# EAGLE design rev1 (EAGLE 6.4)
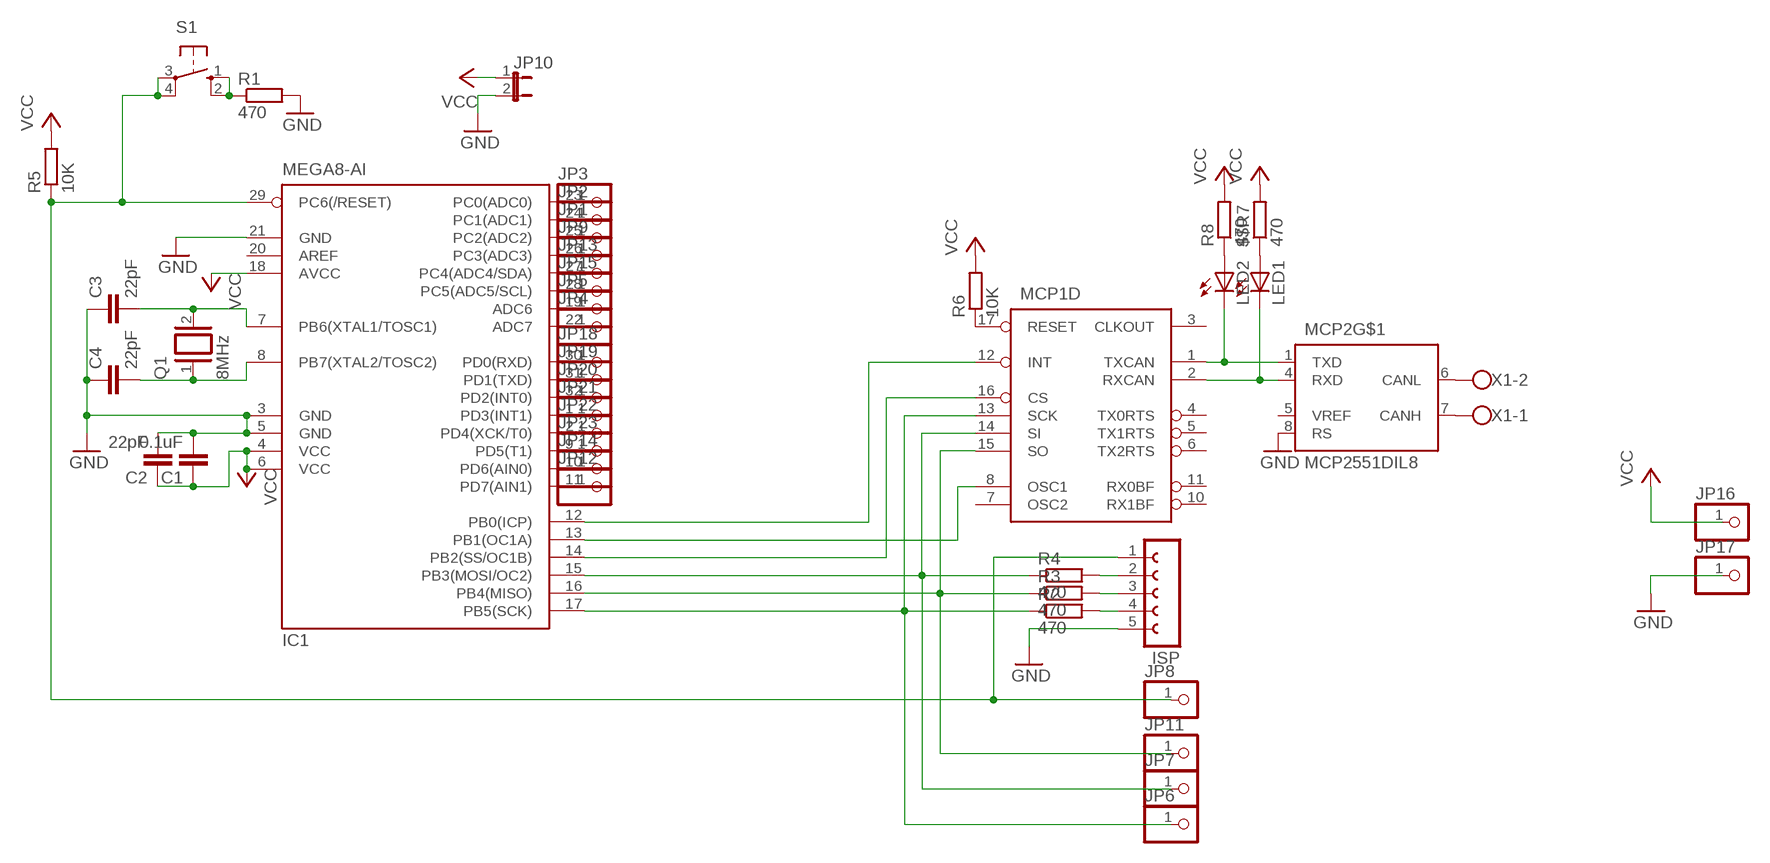
[diagram p0: schematic, sheet 1]

## Parts
$$R7  470  R-EU_R0603  [R0603]
C1  0.1uF  C-EUC0603  [C0603]
C2  22pF  C-EUC0603  [C0603]
C3  22pF  C-EUC0603  [C0603]
C4  22pF  C-EUC0603  [C0603]
IC1  MEGA8-AI  [TQFP32-08]
ISP  FE05-1  [FE05-1]
JP1  PINHD-1X1  [1X01]
JP2  PINHD-1X1  [1X01]
JP3  PINHD-1X1  [1X01]
JP4  PINHD-1X1  [1X01]
JP5  PINHD-1X1  [1X01]
JP6  PINHD-1X1  [1X01]
JP7  PINHD-1X1  [1X01]
JP8  PINHD-1X1  [1X01]
JP9  PINHD-1X1  [1X01]
JP10  JUMPER-2PTH  [1X02]
JP11  PINHD-1X1  [1X01]
JP12  PINHD-1X1  [1X01]
JP13  PINHD-1X1  [1X01]
JP14  PINHD-1X1  [1X01]
JP15  PINHD-1X1  [1X01]
JP16  PINHD-1X1  [1X01]
JP17  PINHD-1X1  [1X01]
JP18  PINHD-1X1  [1X01]
JP19  PINHD-1X1  [1X01]
JP20  PINHD-1X1  [1X01]
JP21  PINHD-1X1  [1X01]
JP22  PINHD-1X1  [1X01]
JP23  PINHD-1X1  [1X01]
LED1  LEDCHIP-LED0603  [CHIP-LED0603]
LED2  LEDCHIP-LED0603  [CHIP-LED0603]
MCP1  MCP2515P  [DIL18]
MCP2  MCP2551DIL8  [DIL08]
Q1  8MHz  XTAL/S  [QS]
R1  470  R-EU_R0603  [R0603]
R2  470  R-EU_R0603  [R0603]
R3  470  R-EU_R0603  [R0603]
R4  470  R-EU_R0603  [R0603]
R5  10K  R-EU_R0603  [R0603]
R6  10K  R-EU_R0603  [R0603]
R8  470  R-EU_R0603  [R0603]
S1  10-XX  [B3F-10XX]
X1  W237-102  [W237-102]

## Nets
GND: C1.2 C2.2 C3.1 C4.1 IC1.3(GND) IC1.5(GND) IC1.21(GND) ISP.5 JP10.2 JP17.1 MCP2.8(RS) R1.2
N$1: IC1.17(PB5(SCK)) JP6.1 MCP1.13(D:SCK) R2.1
N$2: IC1.16(PB4(MISO)) JP11.1 MCP1.15(D:SO) R3.1
N$3: IC1.15(PB3(MOSI/OC2)) JP7.1 MCP1.14(D:SI) R4.1
N$4: IC1.14(PB2(SS/OC1B)) MCP1.16(D:CS)
N$5: IC1.13(PB1(OC1A)) MCP1.8(D:OSC1)
N$7: LED2.C MCP1.1(D:TXCAN) MCP2.1(TXD)
N$9: C4.2 IC1.8(PB7(XTAL2/TOSC2)) Q1.1
N$10: C3.2 IC1.7(PB6(XTAL1/TOSC1)) Q1.2
N$12: MCP1.17(D:RESET) R6.1
N$13: R1.1 S1.1(S) S1.2(S1)
N$14: IC1.12(PB0(ICP)) MCP1.12(D:INT)
N$15: ISP.2 R4.2
N$16: ISP.3 R3.2
N$17: ISP.4 R2.2
N$18: LED2.A R8.1
N$19: $$R7.1 LED1.A
N$20: IC1.23(PC0(ADC0)) JP3.1
N$21: IC1.24(PC1(ADC1)) JP2.1
N$22: IC1.25(PC2(ADC2)) JP1.1
N$23: IC1.26(PC3(ADC3)) JP9.1
N$24: IC1.27(PC4(ADC4/SDA)) JP13.1
N$25: IC1.28(PC5(ADC5/SCL)) JP15.1
N$26: IC1.19(ADC6) JP5.1
N$27: IC1.22(ADC7) JP4.1
N$28: IC1.30(PD0(RXD)) JP18.1
N$29: IC1.31(PD1(TXD)) JP19.1
N$30: IC1.32(PD2(INT0)) JP20.1
N$31: IC1.1(PD3(INT1)) JP21.1
N$32: IC1.2(PD4(XCK/T0)) JP22.1
N$33: IC1.9(PD5(T1)) JP23.1
N$34: IC1.10(PD6(AIN0)) JP14.1
N$35: IC1.11(PD7(AIN1)) JP12.1
N$36: MCP2.6(CANL) X1.2
N$37: MCP2.7(CANH) X1.1
RESET: IC1.29(PC6(/RESET)) ISP.1 JP8.1 R5.1 S1.3(P) S1.4(P1)
RXLED: LED1.C MCP1.2(D:RXCAN) MCP2.4(RXD)
VCC: $$R7.2 C1.1 C2.1 IC1.4(VCC) IC1.6(VCC) IC1.18(AVCC) JP10.1 JP16.1 R5.2 R6.2 R8.2
Unconnected: IC1.20(AREF) MCP1.3(D:CLKOUT) MCP1.4(D:TX0RTS) MCP1.5(D:TX1RTS) MCP1.6(D:TX2RTS) MCP1.7(D:OSC2) MCP1.10(D:RX1BF) MCP1.11(D:RX0BF) MCP2.5(VREF)

## Power pins joined to a net without a drawn wire
GND: MCP1.9(P:GND) MCP2.2(GND)
VCC: MCP1.18(P:VCC) MCP2.3(VCC)

## Library data of the parts
$$R7 R1-R6 R8 = resistor:R-EU_: RESISTOR, European symbol; OC_NEWARK: unknown
C1-C4 = resistor:C-EU: CAPACITOR, European symbol; OC_NEWARK: unknown
IC1 = atmel:MEGA8: MICROCONTROLLER 8 Kbytes FLASH, 1 kbytes SRAM, 512 bytes EEPROM, USART, 6-channel 10 bit ADC, 2-channel 8 bit ADC Pin compatible with Atmega48, ATMega88, ATMega168 Source: avr.lbr; MPN: ATMEGA8-16AU; OC_FARNELL: 9171371; OC_NEWARK: unknown
ISP = con-lsta:FE05-1: FEMALE HEADER; OC_FARNELL: unknown; OC_NEWARK: unknown
JP1-JP9 JP11-JP23 = pinhead:PINHD-1X1: PIN HEADER
JP10 = SparkFun-Passives:JUMPER-2: Jumper Basic 0.1" spaced jumper. Use with breakaway headers.
LED1 LED2 = led:LED: LED OSRAM: - CHIPLED LG R971, LG N971, LY N971, LG Q971, LY Q971, LO R971, LY R971 LH N974, LH R974 LS Q976, LO Q976, LY Q976 LO Q996 - Hyper CHIPLED LW Q18S LB Q993, LB Q99A, LB R99A - SideLED LS A670, LO A670, LY A670, LG A670, LP A670 LB A673, LV A673, LT A673, LW A673 LH A674 LY A675 LS A676, LA A676, LO A676, LY A676, LW A676 LS A679, LY A679, LG A679 - Hyper Micro SIDELED® LS Y876, LA Y876, LO Y876, LY Y876 LT Y87S - SmartLED LW L88C, LW L88S LB L89C, LB L89S, LG L890 LS L89K, LO L89K, LY L89K LS L896, LA L896, LO L896, LY L896 - TOPLED LS T670, LO T670, LY T670, LG T670, LP T670 LSG T670, LSP T670, LSY T670, LOP T670, LYG T670 LG T671, LOG T671, LSG T671 LB T673, LV T673, LT T673, LW T673 LH T674 LS T676, LA T676, LO T676, LY T676, LB T676, LH T676, LSB T676, LW T676 LB T67C, LV T67C, LT T67C, LS T67K, LO T67K, LY T67K, LW E67C LS E67B, LA E67B, LO E67B, LY E67B, LB E67C, LV E67C, LT E67C LW T67C LS T679, LY T679, LG T679 LS T770, LO T770, LY T770, LG T770, LP T770 LB T773, LV T773, LT T773, LW T773 LH T774 LS E675, LA E675, LY E675, LS T675 LS T776, LA T776, LO T776, LY T776, LB T776 LHGB T686 LT T68C, LB T68C - Hyper Mini TOPLED® LB M676 - Mini TOPLED Santana® LG M470 LS M47K, LO M47K, LY M47K Source: http://www.osram.convergy.de LUXEON: - LUMILED® LXK2-PW12-R00, LXK2-PW12-S00, LXK2-PW14-U00, LXK2-PW14-V00 LXK2-PM12-R00, LXK2-PM12-S00, LXK2-PM14-U00 LXK2-PE12-Q00, LXK2-PE12-R00, LXK2-PE12-S00, LXK2-PE14-T00, LXK2-PE14-U00 LXK2-PB12-K00, LXK2-PB12-L00, LXK2-PB12-M00, LXK2-PB14-N00, LXK2-PB14-P00, LXK2-PB14-Q00 LXK2-PR12-L00, LXK2-PR12-M00, LXK2-PR14-Q00, LXK2-PR14-R00 LXK2-PD12-Q00, LXK2-PD12-R00, LXK2-PD12-S00 LXK2-PH12-R00, LXK2-PH12-S00 LXK2-PL12-P00, LXK2-PL12-Q00, LXK2-PL12-R00 Source: www.luxeon.com KINGBRIGHT: KA-3528ASYC Source: www.kingbright.com
MCP1 = can:MCP2515: MC2515 Stand-Alone CAN Controller With SPI Interface, Microchip; OC_NEWARK: unknown
MCP2 = can:MCP2551: CAN Tranceiver Microchip; OC_NEWARK: unknown
Q1 = special:XTAL/S: CRYSTAL; OC_NEWARK: unknown
S1 = switch-omron:10-XX: OMRON SWITCH; MPN: B3F-1000; OC_FARNELL: 176432; OC_NEWARK: 36M3542
X1 = con-wago-500:W237-102: WAGO SCREW CLAMP; MPN: 237-102; OC_FARNELL: unknown; OC_NEWARK: 70K9898

## Board
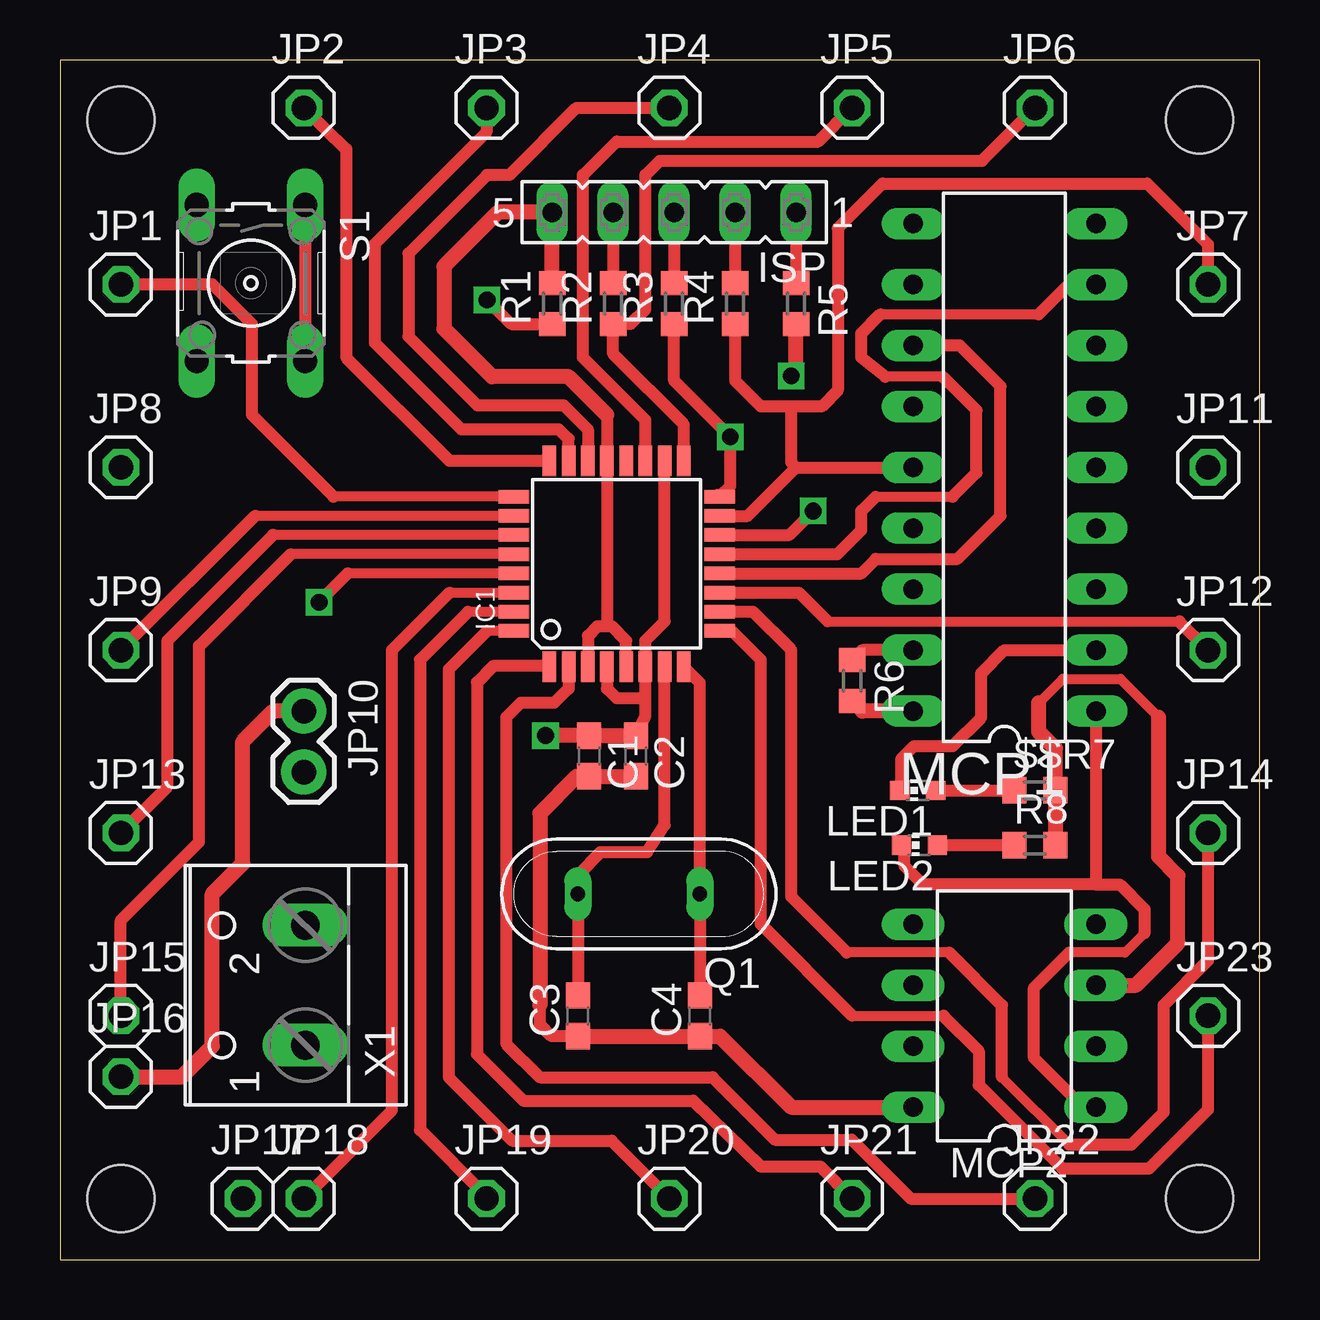
[diagram p1: board, top side]
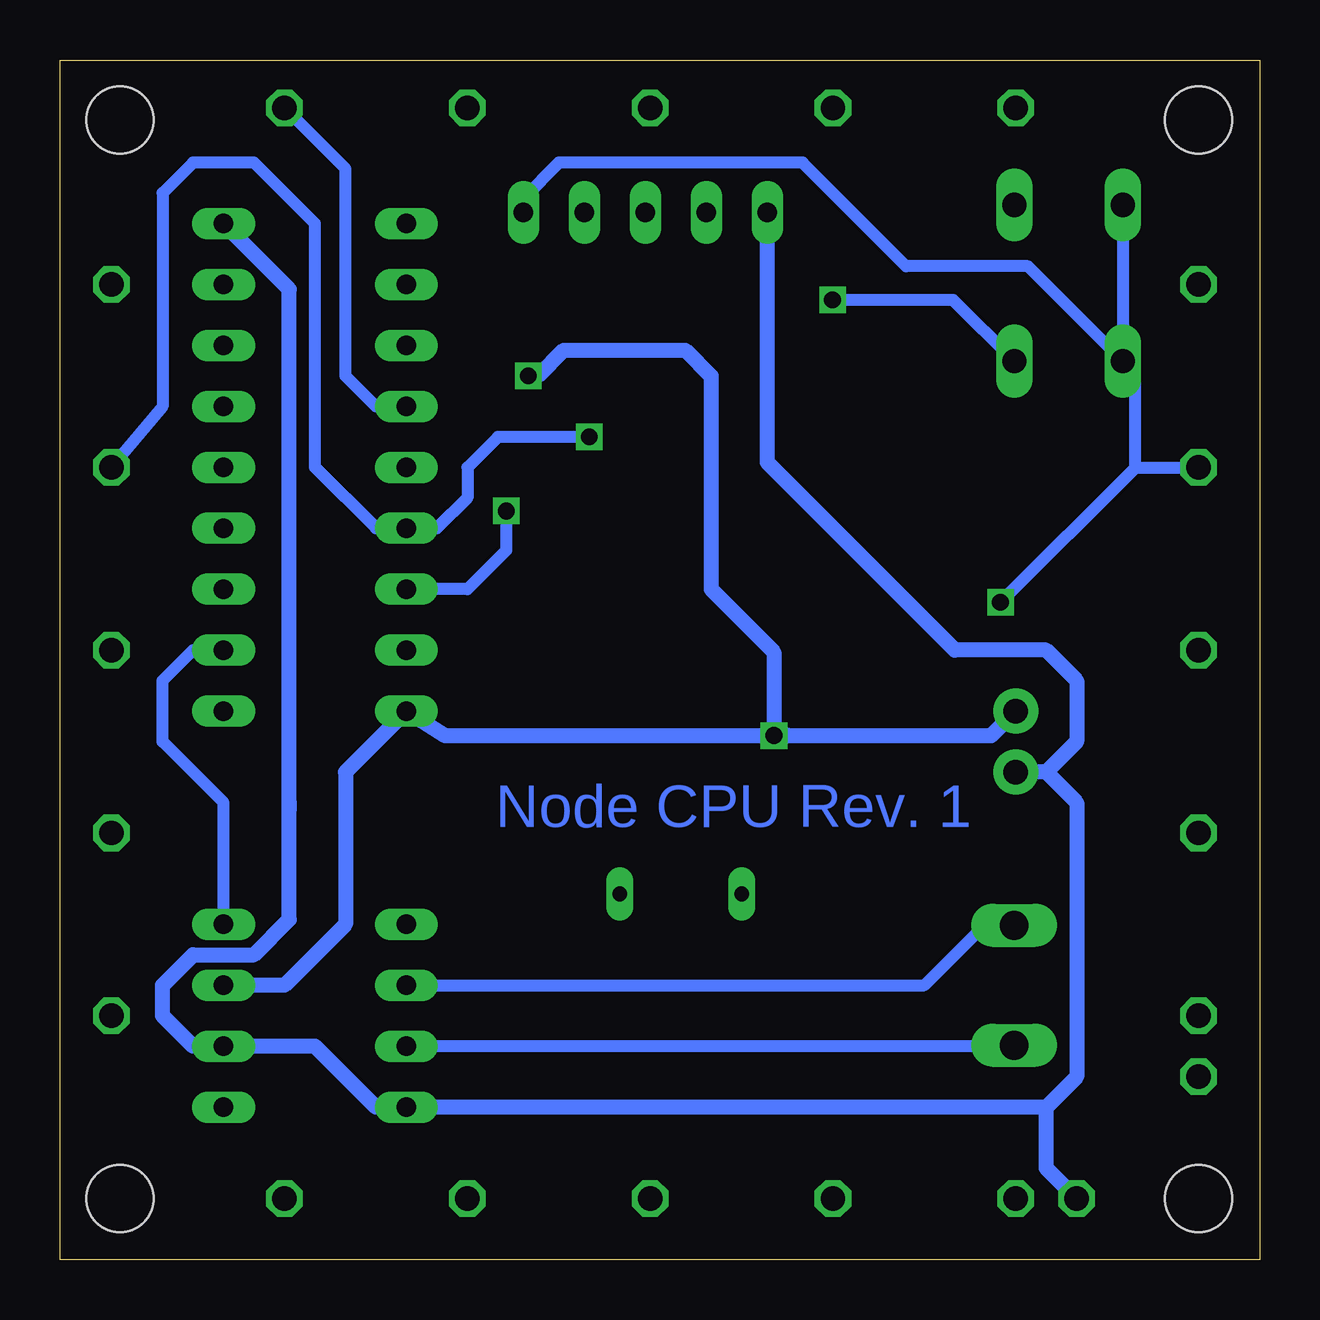
[diagram p2: board, bottom side, seen from below]

Size 50 x 50 mm. Coordinates in mm from the lower left corner, seen from the top.
Outline: 0,0 50,0 50,50 0,50 0,0
Copper layers (1*16): Top 0.035mm / dielectric 1.5mm / Bottom 0.035mm
Design rules "default": minimum track width 10mil, minimum drill 24mil, track to track 8mil, track to pad 8mil, pad to pad 8mil, via to via 8mil, smd to smd 8mil, copper to edge 40mil, drill to drill 8mil, minimum pad ring 10mil, minimum via ring 8mil, stop-mask expansion 4mil, vias tented up to drill 0mil, thermal gap 10mil
Holes 2.8 mm at 2.54,47.5 47.5,47.5 47.5,2.54 2.54,2.54

### Footprints (pad centres in the part's own frame; a part is rotated, then mirrored left to right if it is on the bottom)
R0603 = smd 1 x 1.1: 1 -0.85,0; 2 0.85,0
C0603 = smd 1.1 x 1: 1 -0.85,0; 2 0.85,0
TQFP32-08 = smd 1.27 x 0.559: 1 -4.293,2.8; 2 -4.293,2; 3 -4.293,1.2; 4 -4.293,0.4; 5 -4.293,-0.4; 6 -4.293,-1.2; 7 -4.293,-2; 8 -4.293,-2.8; 17 4.293,-2.8; 18 4.293,-2; 19 4.293,-1.2; 20 4.293,-0.4; 21 4.293,0.4; 22 4.293,1.2; 23 4.293,2; 24 4.293,2.8 | smd 0.559 x 1.27: 9 -2.8,-4.293; 10 -2,-4.293; 11 -1.2,-4.293; 12 -0.4,-4.293; 13 0.4,-4.293; 14 1.2,-4.293; 15 2,-4.293; 16 2.8,-4.293; 25 2.8,4.293; 26 2,4.293; 27 1.2,4.293; 28 0.4,4.293; 29 -0.4,4.293; 30 -1.2,4.293; 31 -2,4.293; 32 -2.8,4.293
FE05-1 = drill 0.813 long: 1 -5.08,0; 2 -2.54,0; 3 0,0; 4 2.54,0; 5 5.08,0
1X01 = drill 1.016 octagon: 1 0,0
1X02 = drill 1.016 pad 1.88: 1 0,0; 2 2.54,0
CHIP-LED0603 = smd 0.8 x 0.8: A 0,-0.75; C 0,0.75
DIL18 = drill 0.813 long: 1 -10.16,-3.81; 2 -7.62,-3.81; 3 -5.08,-3.81; 4 -2.54,-3.81; 5 0,-3.81; 6 2.54,-3.81; 7 5.08,-3.81; 8 7.62,-3.81; 9 10.16,-3.81; 10 10.16,3.81; 11 7.62,3.81; 12 5.08,3.81; 13 2.54,3.81; 14 0,3.81; 15 -2.54,3.81; 16 -5.08,3.81; 17 -7.62,3.81; 18 -10.16,3.81
DIL08 = drill 0.813 long: 1 -3.81,-3.81; 2 -1.27,-3.81; 3 1.27,-3.81; 4 3.81,-3.81; 5 3.81,3.81; 6 1.27,3.81; 7 -1.27,3.81; 8 -3.81,3.81
QS = drill 0.61 long: 1 -2.54,0; 2 2.54,0
B3F-10XX = drill 1.016 long: 1 -3.251,2.261; 2 3.251,2.261; 3 -3.251,-2.261; 4 3.251,-2.261
W237-102 = drill 1.194 long: 1 -2.5,-1.27; 2 2.5,-1.27

### Placement (x,y rotation side)
$$R7  40.64,19.56 0 top
C1  22.06,20.99 270 top
C2  24,20.99 270 top
C3  21.59,10.16 90 top
C4  26.67,10.16 90 top
IC1  23.2,29 90 top
ISP  25.6,43.65 180 top
JP1  2.54,40.64 0 top
JP2  10.16,48.01 0 top
JP3  17.78,48.01 0 top
JP4  25.4,48.01 0 top
JP5  33.02,48.01 0 top
JP6  40.64,48.01 0 top
JP7  47.86,40.64 0 top
JP8  2.54,33.02 0 top
JP9  2.54,25.4 0 top
JP10  10.16,22.86 270 top
JP11  47.86,33.02 0 top
JP12  47.86,25.4 0 top
JP13  2.54,17.78 0 top
JP14  47.86,17.78 0 top
JP15  2.54,10.16 0 top
JP16  2.54,7.62 0 top
JP17  7.62,2.54 0 top
JP18  10.16,2.54 0 top
JP19  17.78,2.54 0 top
JP20  25.4,2.54 0 top
JP21  33.02,2.54 0 top
JP22  40.64,2.54 0 top
JP23  47.86,10.16 0 top
LED1  35.75,19.56 90 top
LED2  35.82,17.27 90 top
MCP1  39.37,33.02 90 top
MCP2  39.37,10.16 90 top
Q1  24.13,15.24 180 top
R1  20.52,39.84 90 top
R2  23.06,39.84 90 top
R3  25.6,39.84 90 top
R4  28.14,39.84 90 top
R5  30.68,39.84 270 top
R6  33.02,24.13 270 top
R8  40.64,17.27 0 top
S1  7.96,40.7 270 top
X1  8.96,11.43 90 top

### Tracks (layer width: path | path; a pad name or v marks a point on that pad's centre or on a via)
GND
  Top 0.305: R1.2 20.5,40.67
  Top 0.508: 22.8,35.2 IC1.21 22.8,26.4 | IC1.3 22,26 22.4,26.4 22.8,26.4 | IC1.5 23.6,25.8 23,26.4 22.8,26.4 | 21.29,9.31 20.49,9.31 20,9.8 20,10.6
  Top 0.635: 20,10.6 20,18.6 21.54,20.14 C1.2 C2.2 | 21.29,9.31 C3.1 C4.1 27.52,9.31 30.48,6.35 MCP2.8 | 22.8,35.2 21.2,36.8 18,36.8 16,38.8 16,41.4 18.25,43.65 ISP.5 20.52,40.79 20.47,40.74 R1.2 20.43,40.6
  Bottom 0.635: 40.44,19.05 40.44,18.78 | ISP.5 20.52,33.22 12.7,25.4 8.89,25.4 7.62,24.13 7.62,21.59 8.89,20.32 | 8.89,6.35 7.62,7.62 7.62,19.05 8.89,20.32 | 8.89,6.35 MCP2.8 36.83,6.35 39.37,8.89 MCP2.2 44.45,8.89 45.72,10.16 45.72,11.43 44.45,12.7 41.91,12.7 40.44,14.17 40.44,19.05 | 8.89,20.32 JP10.2 | JP17.1 8.89,3.81 8.89,6.35 | 40.44,19.05 40.44,40.44 MCP1.9
N$1
  Top 0.508: JP6.1 38.43,45.8 25,45.8 24.4,45.2 24.4,39.6 23.79,38.99 R2.1 23.06,37.74 26,34.8 IC1.17
  Bottom 0.508: MCP1.13 36.83,35.56 38.1,36.83 38.1,45.47 JP6.1
N$2  (via drill 0.7)
  Top 0.508: 25.78,38.99 R3.1 25.6,36.63 v27.94,34.29 27.94,32.25 IC1.16 27.41,31.88
  Bottom 0.508: JP11.1 45.72,35.56 45.72,44.45 44.45,45.72 41.91,45.72 39.37,43.18 39.37,33.02 36.83,30.48 MCP1.15 34.29,30.48 33.02,31.75 33.02,33.02 31.75,34.29 v27.94,34.29
N$3
  Top 0.508: 28.32,38.99 R4.1 28.14,36.63 29.21,35.56 30.48,35.56 | IC1.15 28.66,31 30.68,33.02 | 30.48,35.56 31.75,35.56 32.42,36.23 32.42,42.98 34.29,44.85 45.32,44.85 47.86,42.31 JP7.1 | 30.68,33.02 MCP1.14 | 30.68,33.02 30.48,33.22 30.48,35.56
N$4  (via drill 0.7)
  Top 0.508: IC1.14 30.4,30.2 v31.4,31.2
  Bottom 0.508: v31.4,31.2 31.4,29.56 33.02,27.94 MCP1.16
N$5
  Top 0.406: 34,31.8 37.2,31.8 | 36.8,36.8 34.4,36.8 | 34.2,39.4 40.8,39.4
  Top 0.508: IC1.13 32.4,29.4 33.4,30.4 33.4,31.2 34,31.8 | 37.2,31.8 38.2,32.8 38.2,35.4 36.8,36.8 | 34.4,36.8 33.4,37.6 33.4,38.6 34.2,39.4 | 40.8,39.4 42.04,40.64 MCP1.8
N$7
  Top 0.406: 45.2,13.6 44.4,12.8 42.07,12.8
  Top 0.508: MCP1.1 43.18,15.63 | 45.2,13.6 45.2,14.6 44.17,15.63 43.18,15.63 | 42.07,12.8 40.6,11.33 40.6,8.4 42.65,6.35 MCP2.1 | 43.18,15.63 35.97,15.63 35.2,16.4 35.2,17.14 LED2.C
N$9
  Top 0.508: C4.2 Q1.1 26.67,24.04 IC1.8
N$10
  Top 0.508: IC1.7 25.2,18.11 24.47,16.98 22.53,16.98 21.59,16.04 Q1.2 C3.2
N$12
  Top 0.508: MCP1.17 33.44,25.4 R6.1
N$13  (via drill 0.7)
  Top 0.508: v17.8,40 18.81,38.99 R1.1 | S1.1 S1.2
  Bottom 0.508: S1.2 12.77,40 v17.8,40
N$14
  Top 0.508: IC1.12 33.4,28.6 34,29.2 37.4,29.2 39.2,31 39.2,36.4 37.5,38.1 MCP1.12
N$15
  Top 0.508: ISP.2 R4.2
N$16
  Top 0.508: ISP.3 R3.2
N$17
  Top 0.508: ISP.4 R2.2
N$18
  Top 0.508: LED2.A R8.1
N$19
  Top 0.508: LED1.A $$R7.1
N$20
  Top 0.508: IC1.23 21.2,34.2 20.8,34.6 16.73,34.6 13.13,38.2 13.13,42.34 17.78,46.99 JP3.1
N$21
  Top 0.508: IC1.24 16.24,33.29 11.93,37.6 11.93,46.29 JP2.1
N$22
  Top 0.406: IC1.25 11.4,31.8
  Top 0.508: 2.58,40.6 JP1.1 6.36,40.64 8,39 8,35.2 11.4,31.8
N$23
  Top 0.406: IC1.26 8.14,31
  Top 0.508: 8.14,31 JP9.1
N$24
  Top 0.406: IC1.27 8.88,30.2
  Top 0.508: JP13.1 4.48,19.72 4.48,25.8 8.88,30.2
N$25
  Top 0.406: IC1.28 9.62,29.4
  Top 0.508: 9.62,29.4 5.8,25.58 5.8,17.4 2.54,14.14 JP15.1
N$26
  Top 0.508: IC1.19 24.4,35 21.8,37.6 21.8,45.2 23.2,46.6 31.61,46.6 JP5.1
N$27
  Top 0.508: IC1.22 22,34.6 21,35.6 17.4,35.6 14.53,38.47 14.53,41.93 17.8,45.2 18.73,45.2 21.54,48.01 JP4.1
N$28
  Top 0.406: 16.24,27.8 IC1.30
  Top 0.508: JP18.1 13.84,6.22 13.84,25.4 16.24,27.8
N$29
  Top 0.406: IC1.31 17,27
  Top 0.508: 17,27 15,25 15,5.4 17.78,2.62 JP19.1
N$30
  Top 0.406: IC1.32 17.8,26.2
  Top 0.508: 17.8,26.2 16.2,24.6 16.2,7.6 18.85,4.95 22.99,4.95 JP20.1
N$31
  Top 0.508: IC1.1 20.42,24.73 18.05,24.73 17.38,24.06 17.38,8.56 19.32,6.62 26.4,6.62 29.21,3.88 31.68,3.88 JP21.1
N$32
  Top 0.508: IC1.2 21.2,23.8 20.6,23.2 19.2,23.2 18.6,22.6 18.6,9 20,7.6 27.2,7.6 29.8,5 33,5 35.46,2.54 JP22.1
N$33
  Top 0.406: 33.02,10.16 36.83,10.16
  Top 0.508: IC1.9 28,26.2 29.21,24.99 29.21,13.97 33.02,10.16 | 36.83,10.16 38.3,8.69 38.3,7.28 41.78,3.8 45.4,3.8 47.86,6.26 JP23.1
N$34
  Top 0.406: 39.27,7.6 42.07,4.8 | 37.07,12.8 32.8,12.8
  Top 0.508: 42.07,4.8 44.67,4.8 46,6.13 46,10.6 47.86,12.46 JP14.1 | 39.27,7.6 39.27,10.6 37.07,12.8 | IC1.10 28.88,27 30.48,25.4 30.48,15.12 32.8,12.8
N$35
  Top 0.406: 32,26.6 46.66,26.6
  Top 0.508: IC1.11 30.8,27.8 32,26.6 | 46.66,26.6 JP12.1
N$36
  Bottom 0.508: MCP2.6 13.97,11.43 11.47,13.93 X1.2
N$37
  Bottom 0.508: X1.1 11.47,8.89 MCP2.7
RESET  (via drill 0.7)
  Top 0.406: IC1.29 11.99,28.6
  Top 0.508: ISP.1 R5.1 | 11.99,28.6 v10.8,27.41 v10.8,27.4
  Bottom 0.508: 30.68,43.48 ISP.1 30.68,44.25 29.21,45.72 19.05,45.72 14.73,41.4 9.65,41.4 S1.4 | v10.8,27.4 5.18,33.02 | 5.18,33.02 JP8.1 | 5.18,33.02 5.18,36.93 S1.4 | S1.3 S1.4
RXLED
  Top 0.508: MCP1.2 39.37,25.4 38.4,24.43 38.4,22.6 37.2,21.4 35.6,21.4 35.06,20.86 35.06,19.62 LED1.C
  Bottom 0.508: MCP2.4 43.18,19.05 45.72,21.59 45.72,24.13 44.45,25.4 MCP1.2
VCC  (via drill 0.7)
  Top 0.406: 40.8,23.2 41.8,24.2 44.2,24.2 45.8,22.6
  Top 0.508: C2.1 24.4,22.64 24.4,23.4 | 24.4,23.4 IC1.6 24.4,25.8 25.2,26.6 IC1.18 | 24.4,23.4 23.2,23.4 22.8,23.8 IC1.4
  Top 0.635: R8.2 $$R7.2 41.49,21.31 40.8,22 40.8,23.2 | MCP2.3 44.85,11.43 46.6,13.18 46.6,16 45.8,16.8 45.8,22.6 | v20.24,21.84 C1.1 C2.1 | v30.48,36.83 30.68,37.03 R5.2 | MCP1.18 33.44,22.86 R6.2 | JP10.1 8.89,22.86 7.62,21.59 7.62,16.51 6.35,15.24 6.35,8.89 5.08,7.62 JP16.1
  Bottom 0.635: MCP2.3 40.64,11.43 38.1,13.97 38.1,20.32 MCP1.18 33.94,21.84 v20.24,21.84 | v20.24,21.84 11.18,21.84 JP10.1 | 19.59,21.84 v20.24,21.84 | v20.24,21.84 20.24,25.32 22.86,27.94 22.86,36.83 23.93,37.9 29.01,37.9 30.08,36.83 v30.48,36.83

### Text on the board
Bottom: Node CPU Rev. 1